# Altium schematic sheet A3000_8MB_Glue.SchDoc
size A3; DocumentNumber: 1; SheetNumber: 1; SheetTotal: 5
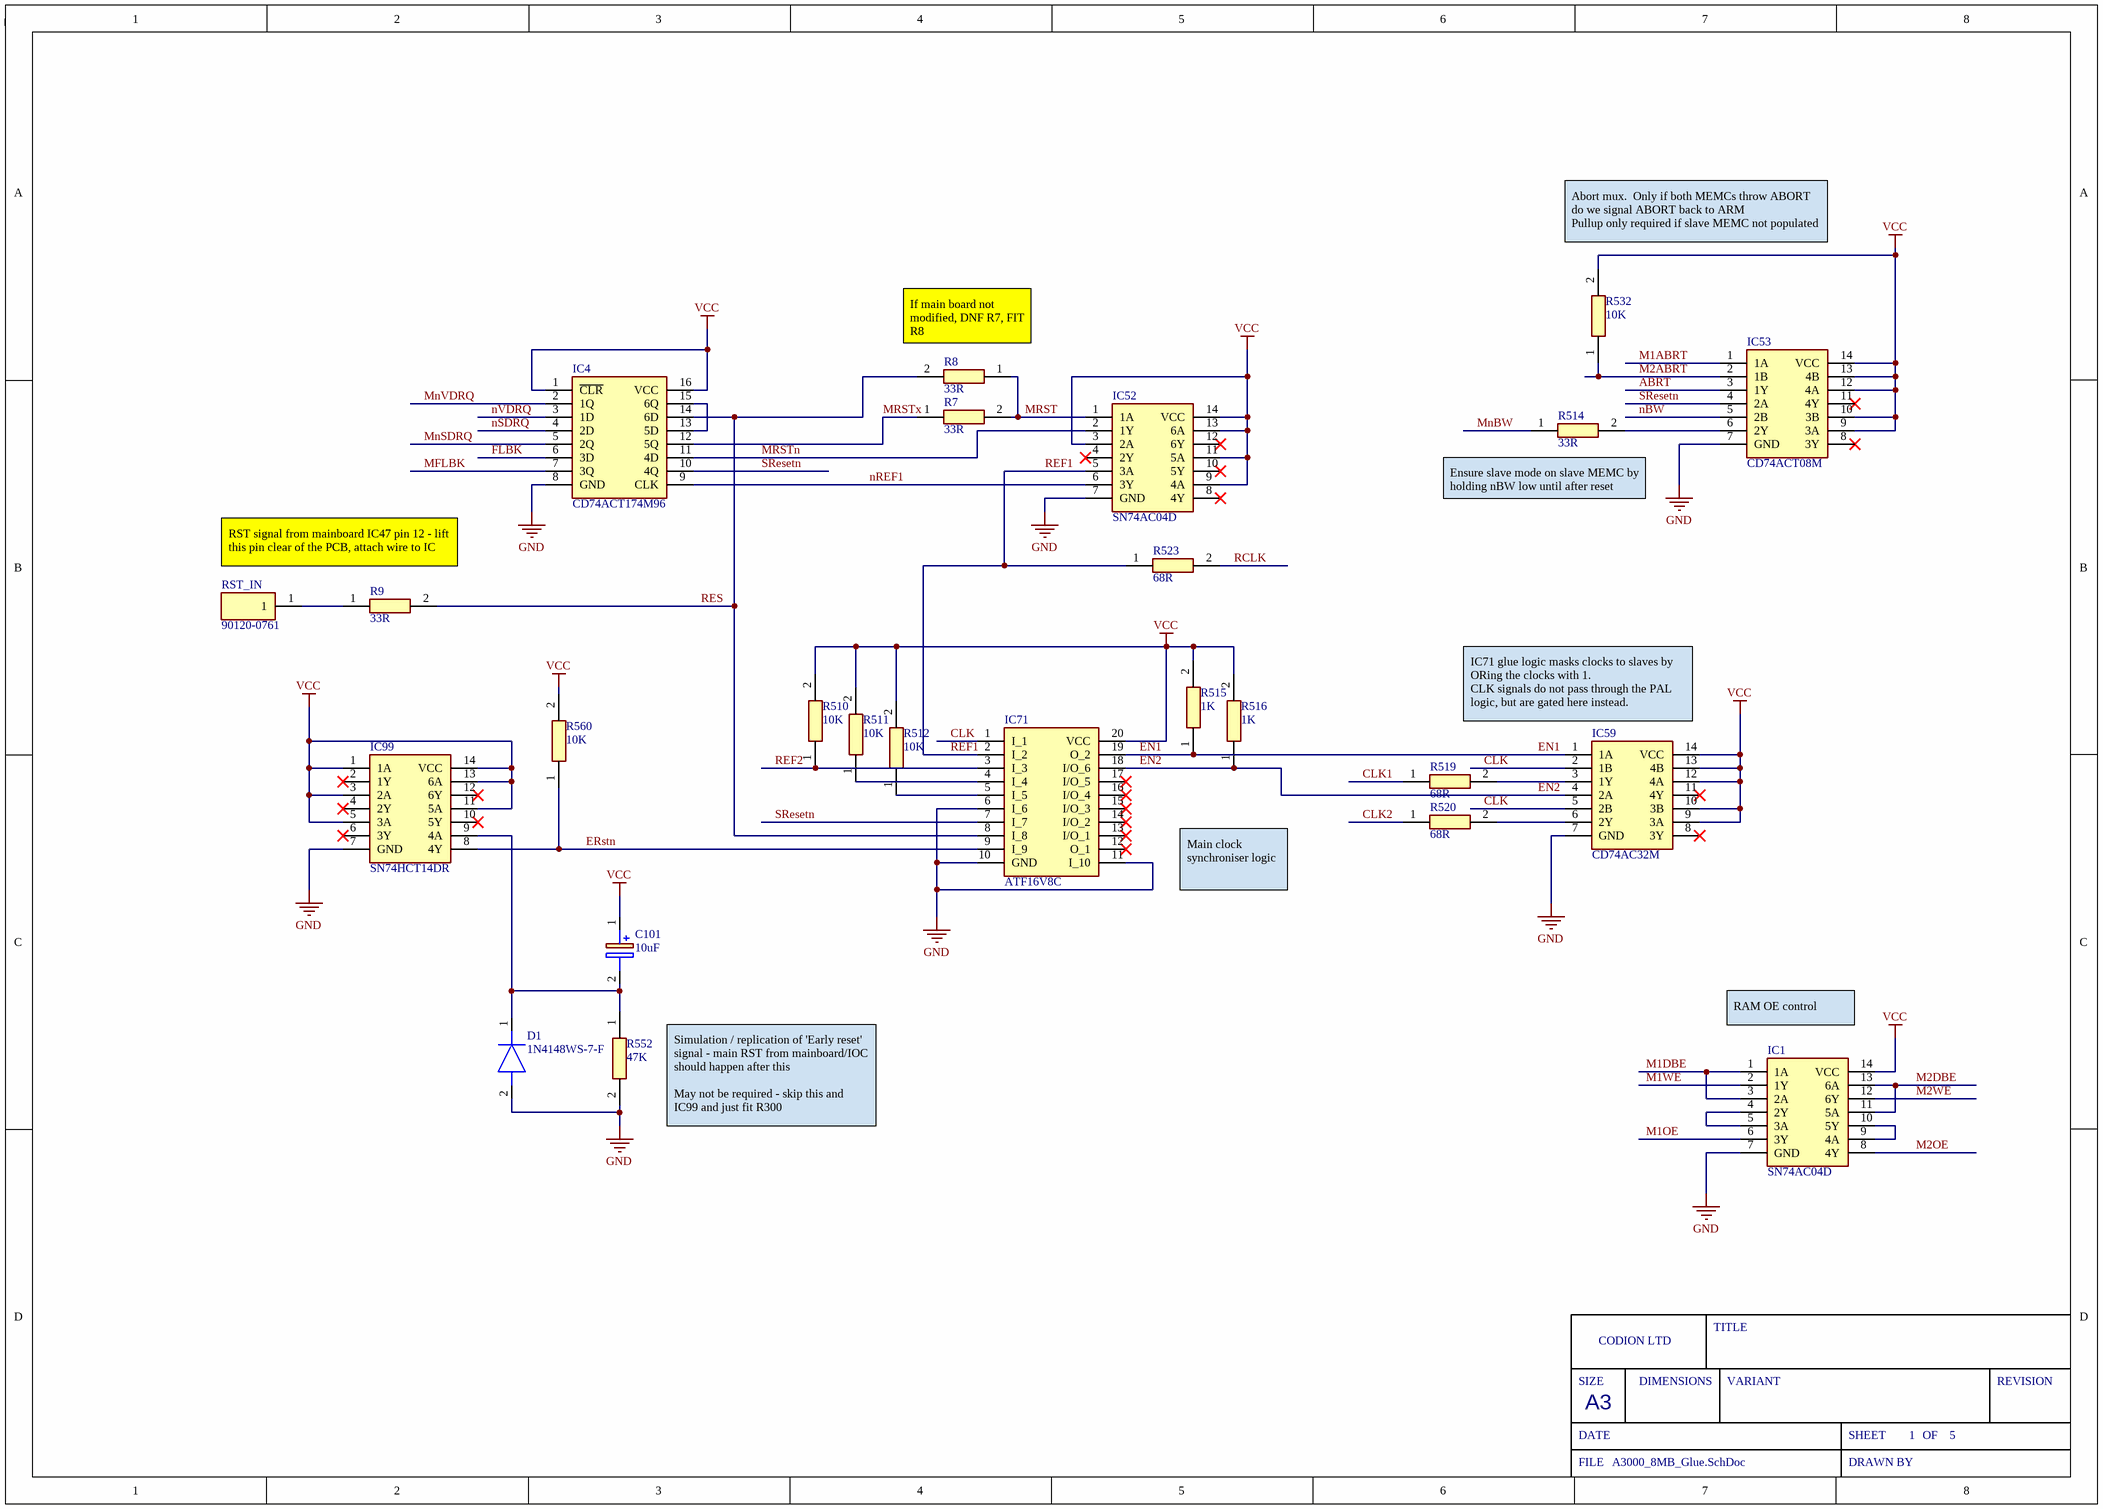
[diagram p0: A3000_8MB_Glue.SchDoc]

## Parts
C101  10uF  [EEE0GA101SR]
D1  1N4148WS-7-F  [SOD2513X120N]
IC1  SN74AC04D  [SOIC127P600X175-14N]
IC4  CD74ACT174M96  [SOIC127P600X175-16N]
IC52  SN74AC04D  [SOIC127P600X175-14N]
IC53  CD74ACT08M  [SOIC127P600X175-14N]
IC59  CD74AC32M  [SOIC127P600X175-14N]
IC71  ATF16V8C  [DIP762W66P254L2692H508Q20N]
IC99  SN74HCT14DR  [SOIC127P600X175-14N]
R7  33R  [RESC1005X40N]
R8  33R  [RESC1005X40N]
R9  33R  [RESC1005X40N]
R510  10K  [RESC1005X40N]
R511  10K  [RESC1005X40N]
R512  10K  [RESC1005X40N]
R514  33R  [RESC1005X40N]
R515  1K  [RESC1005X40N]
R516  1K  [RESC1005X40N]
R519  68R  [RESC1005X40N]
R520  68R  [RESC1005X40N]
R523  68R  [RESC1005X40N]
R532  10K  [RESC1005X40N]
R552  47K  [RESC1005X40N]
R560  10K  [RESC1005X40N]
RST_IN  90120-0761  [HDRV1W90P0X254_1X1_232X249X560P]

## Nets
GND: D1.2(A) IC1.7(GND) IC4.8(GND) IC52.7(GND) IC53.7(GND) IC59.7(GND) IC71.6(I_6) IC71.10(GND) IC71.11(I_10) IC99.7(GND) R552.2
VCC: C101.1(+) IC1.14(VCC) IC4.1(~{CLR}) IC4.16(VCC) IC52.3(2A) IC52.9(4A) IC52.11(5A) IC52.13(6A) IC52.14(VCC) IC53.9(3A) IC53.10(3B) IC53.12(4A) IC53.13(4B) IC53.14(VCC) IC59.9(3A) IC59.10(3B) IC59.12(4A) IC59.13(4B) IC59.14(VCC) IC71.20(VCC) IC99.1(1A) IC99.3(2A) IC99.5(3A) IC99.11(5A) IC99.13(6A) IC99.14(VCC) R510.2 R511.2 R512.2 R515.2 R516.2 R532.2 R560.2
ABRT: IC53.3(1Y)
CLK: IC59.2(1B) IC59.5(2B) IC71.1(I_1)
CLK1: R519.1
CLK2: R520.1
EN1: IC59.1(1A) IC71.19(O_2) R515.1
EN2: IC59.4(2A) IC71.18(I/O_6) R516.1
ERstn: IC71.9(I_9) IC99.8(4Y) R560.1
FLBK: IC4.6(3D)
M1ABRT: IC53.1(1A)
M1DBE: IC1.1(1A) IC1.3(2A)
M1OE: IC1.6(3Y)
M1WE: IC1.2(1Y)
M2ABRT: IC53.2(1B) R532.1
M2DBE: IC1.11(5A) IC1.13(6A)
M2OE: IC1.8(4Y)
M2WE: IC1.12(6Y)
MFLBK: IC4.7(3Q)
MnBW: R514.1
MnSDRQ: IC4.5(2Q)
MnVDRQ: IC4.2(1Q)
MRST: IC52.1(1A) R7.2 R8.1
MRSTn: IC4.11(4D) IC52.2(1Y)
MRSTx: IC4.12(5Q) R7.1
nBW: IC53.5(2B)
nREF1: IC4.9(CLK) IC52.6(3Y)
nSDRQ: IC4.4(2D)
nVDRQ: IC4.3(1D)
RCLK: R523.2
REF1: IC52.5(3A) IC71.2(I_2) R523.1
REF2: IC71.3(I_3) R510.1
RES: IC4.14(6D) IC71.8(I_8) R8.2 R9.2
SResetn: IC4.10(4Q) IC53.4(2A) IC71.7(I_7)
NetC101_2: C101.2(-) D1.1(K) IC99.9(4A) R552.1
NetIC1_4: IC1.4(2Y) IC1.5(3A)
NetIC1_9: IC1.9(4A) IC1.10(5Y)
NetIC4_13: IC4.13(5D) IC4.15(6Q)
NetIC53_6: IC53.6(2Y) R514.2
NetIC59_3: IC59.3(1Y) R519.2
NetIC59_6: IC59.6(2Y) R520.2
NetIC71_4: IC71.4(I_4) R511.1
NetIC71_5: IC71.5(I_5) R512.1
NetR9_1: R9.1 RST_IN.1

Not connected (* = marked no-connect by the designer): IC52 4(2Y)* 8(4Y)* 10(5Y)* 12(6Y)*; IC53 8(3Y)* 11(4Y)*; IC59 8(3Y)* 11(4Y)*; IC71 12(O_1)* 13(I/O_1)* 14(I/O_2)* 15(I/O_3)* 16(I/O_4)* 17(I/O_5)*; IC99 2(1Y)* 4(2Y)* 6(3Y)* 10(5Y)* 12(6Y)*

## Notes on the sheet
- Abort mux.  Only if both MEMCs throw ABORT do we signal ABORT back to ARM
  Pullup only required if slave MEMC not populated
- (near R8) If main board not modified, DNF R7, FIT R8
- (near R514) Ensure slave mode on slave MEMC by holding nBW low until after reset
- RST signal from mainboard IC47 pin 12 - lift this pin clear of the PCB, attach wire to IC
- (near IC59) IC71 glue logic masks clocks to slaves by ORing the clocks with 1.
  CLK signals do not pass through the PAL logic, but are gated here instead.
- Main clock synchroniser logic
- (near IC1) RAM OE control
- Simulation / replication of 'Early reset' signal - main RST from mainboard/IOC should happen after this
  May not be required - skip this and IC99 and just fit R300
- SIZE
- CODION LTD
- DIMENSIONS
- TITLE
- VARIANT
- REVISION
- DATE
- A3
- SHEET
- OF
- FILE
- DRAWN BY

## Library data of the parts
C101 = EEE-1EA100SR: Capacitor Polarised; Manufacturer_Name: Panasonic; Datasheet Link: http://industrial.panasonic.com/cdbs/www-data/pdf/RDE0000/ABA0000C1145.pdf; Height: 6.5mm; Manufacturer_Part_Number: EEE-1EA100SR; Mouser Part Number: 667-EEE-1EA100SR; Mouser Price/Stock: https://www.mouser.co.uk/ProductDetail/Panasonic/EEE-1EA100SR?qs=ANJC8C65Mw4%2Fvo1GoepKcQ%3D%3D; Arrow Part Number: EEE-1EA100SR; Arrow Price/Stock: https://www.arrow.com/en/products/eee-1ea100sr/panasonic?region=nac
D1 = 1N4148WS-7-F: Diode; Manufacturer_Name: Diodes Inc.; Datasheet Link: https://componentsearchengine.com/Datasheets/2/1N4148WS-7-F.pdf; Height: 1.2mm; Manufacturer_Part_Number: 1N4148WS-7-F; Mouser Part Number: 621-1N4148WS-F; Mouser Price/Stock: https://www.mouser.co.uk/ProductDetail/Diodes-Incorporated/1N4148WS-7-F?qs=4drIV0IxA0r8aNy7%2Fu4kVw%3D%3D; Arrow Part Number: 1N4148WS-7-F; Arrow Price/Stock: https://www.arrow.com/en/products/1n4148ws-7-f/diodes-incorporated?region=asia; LCSC Part #: C2128
IC1 IC52 = SN74AC04D: Integrated Circuit; Manufacturer_Name: Texas Instruments; Datasheet Link: http://www.ti.com/lit/ds/symlink/sn74ac04.pdf; Height: 1.75mm; Manufacturer_Part_Number: SN74AC04D; Mouser Part Number: 595-SN74AC04D; Mouser Price/Stock: https://www.mouser.co.uk/ProductDetail/Texas-Instruments/SN74AC04D?qs=w32V8uFkMxkvsyMHHacuZw%3D%3D; Arrow Part Number: SN74AC04D; Arrow Price/Stock: https://www.arrow.com/en/products/sn74ac04d/texas-instruments?region=nac; LCSC Part #: C352940
IC4 = CD74ACT174M96: Integrated Circuit; Manufacturer_Name: Texas Instruments; Datasheet Link: http://www.ti.com/lit/gpn/cd74act174; Height: 1.75mm; Manufacturer_Part_Number: CD74ACT174M96; Mouser Part Number: 595-CD74ACT174M96; Mouser Price/Stock: https://www.mouser.co.uk/ProductDetail/Texas-Instruments/CD74ACT174M96?qs=w32V8uFkMxkDXs1ka6HDkg%3D%3D
IC53 = CD74ACT08M: Integrated Circuit; Manufacturer_Name: Texas Instruments; Datasheet Link: http://www.ti.com/lit/ds/symlink/cd74act08.pdf; Height: 1.75mm; Manufacturer_Part_Number: CD74ACT08M; Mouser Part Number: 595-CD74ACT08M; Mouser Price/Stock: https://www.mouser.co.uk/ProductDetail/Texas-Instruments/CD74ACT08M?qs=Dqy2GfToSoQdsNWXM2phYA%3D%3D; LCSC Part #: C233452
IC59 = CD74AC32M: Integrated Circuit; Manufacturer_Name: Texas Instruments; Datasheet Link: http://www.ti.com/lit/ds/symlink/cd74ac32.pdf; Height: 1.75mm; Manufacturer_Part_Number: CD74AC32M; Mouser Part Number: 595-CD74AC32M; Mouser Price/Stock: https://www.mouser.co.uk/ProductDetail/Texas-Instruments/CD74AC32M?qs=OorDGPQ79Eqsy7tzrsTtUg%3D%3D; Arrow Part Number: CD74AC32M; Arrow Price/Stock: https://www.arrow.com/en/products/cd74ac32m/texas-instruments; LCSC Part #: C352943
IC71 = PAL16R4AMJ: Integrated Circuit; Manufacturer_Name: Texas Instruments; Datasheet Link: http://www.ti.com/lit/ds/symlink/pal16r4am.pdf; Height: 5.08mm; Manufacturer_Part_Number: PAL16R4AMJ; Mouser Part Number: 595-PAL16R4AMJ; Mouser Price/Stock: https://www.mouser.com/Search/Refine.aspx?Keyword=595-PAL16R4AMJ
IC99 = SN74HCT14DR: Integrated Circuit; Manufacturer_Name: Texas Instruments; Datasheet Link: http://www.ti.com/lit/ds/symlink/sn74hct14.pdf; Height: 1.75mm; Manufacturer_Part_Number: SN74HCT14DR; Mouser Part Number: 595-SN74HCT14DR; Mouser Price/Stock: https://www.mouser.co.uk/ProductDetail/Texas-Instruments/SN74HCT14DR?qs=SL3LIuy2dWxogEVGE105Iw%3D%3D; Arrow Part Number: SN74HCT14DR; Arrow Price/Stock: https://www.arrow.com/en/products/sn74hct14dr/texas-instruments?region=nac; LCSC Part #: C6769
R7-R9 R514 = CRCW040233R0FKED: Resistor; Manufacturer_Name: Vishay; Datasheet Link: http://www.vishay.com/docs/20035/dcrcwe3.pdf; Height: 0.4mm; Manufacturer_Part_Number: CRCW040233R0FKED; Mouser Part Number: 71-CRCW0402-33-E3; Mouser Price/Stock: https://www.mouser.co.uk/ProductDetail/Vishay-Dale/CRCW040233R0FKED?qs=TNtMkGKFKOyo77UGFlXIJw%3D%3D; Arrow Part Number: CRCW040233R0FKED; Arrow Price/Stock: https://www.arrow.com/en/products/crcw040233r0fked/vishay; LCSC Part #: C137880
R510-R512 R532 R560 = CRCW040210K0FKEDHP: Resistor; Manufacturer_Name: Vishay; Datasheet Link: http://www.vishay.com/docs/20035/dcrcwe3.pdf; Height: 0.4mm; Manufacturer_Part_Number: CRCW040210K0FKEDHP; Mouser Part Number: 71-CRCW040210K0FKEDH; Mouser Price/Stock: https://www.mouser.co.uk/ProductDetail/Vishay-Dale/CRCW040210K0FKEDHP?qs=FlFvgi4rxBxmIiaeyFjrkA%3D%3D; Arrow Part Number: CRCW040210K0FKEDHP; Arrow Price/Stock: https://www.arrow.com/en/products/crcw040210k0fkedhp/vishay?region=nac; LCSC Part #: C71617
R515 R516 = CRCW04021K00JNED: Resistor; Manufacturer_Name: Vishay; Datasheet Link: http://www.vishay.com/docs/20035/dcrcwe3.pdf; Height: 0.4mm; Manufacturer_Part_Number: CRCW04021K00JNED; Mouser Part Number: 71-CRCW0402J-1.0K-E3; Mouser Price/Stock: https://www.mouser.co.uk/ProductDetail/Vishay-Dale/CRCW04021K00JNED?qs=YX%252BK5oaHNYpGRsHVuzxl1A%3D%3D; Arrow Part Number: CRCW04021K00JNED; Arrow Price/Stock: https://www.arrow.com/en/products/crcw04021k00jned/vishay; LCSC Part #: C279981
R519 R520 R523 = CRCW040268R0FKEDHP: Resistor; Manufacturer_Name: Vishay; Datasheet Link: http://www.vishay.com/docs/20035/dcrcwe3.pdf; Height: 0.4mm; Manufacturer_Part_Number: CRCW040268R0FKEDHP; Mouser Part Number: 71-CRCW040268R0FKEDH; Mouser Price/Stock: https://www.mouser.co.uk/ProductDetail/Vishay-Dale/CRCW040268R0FKEDHP?qs=YaA%252B3EhhSt26vU44iyW%252BOw%3D%3D; Arrow Part Number: CRCW040268R0FKEDHP; Arrow Price/Stock: https://www.arrow.com/en/products/crcw040268r0fkedhp/vishay; LCSC Part #: C163455
R552 = CRCW040247K0FKED: Resistor; Manufacturer_Name: Vishay; Datasheet Link: http://www.vishay.com/docs/20035/dcrcwe3.pdf; Height: 0.4mm; Manufacturer_Part_Number: CRCW040247K0FKED; Mouser Part Number: 71-CRCW0402-47K-E3; Mouser Price/Stock: https://www.mouser.co.uk/ProductDetail/Vishay-Dale/CRCW040247K0FKED?qs=rzhQWu8UUS0SPbmGf0DOIg%3D%3D; Arrow Part Number: CRCW040247K0FKED; Arrow Price/Stock: https://www.arrow.com/en/products/crcw040247k0fked/vishay; LCSC Part #: C163440
RST_IN = 90120-0761: Connector; Manufacturer_Name: Molex; Datasheet Link: https://www.molex.com/pdm_docs/sd/901200761_sd.pdf; Height: 5.6mm; Manufacturer_Part_Number: 90120-0761; Mouser Part Number: 538-90120-0761; Mouser Price/Stock: https://www.mouser.co.uk/ProductDetail/Molex/90120-0761?qs=PvP5v7Eimsn%2F58TpDaAAow%3D%3D